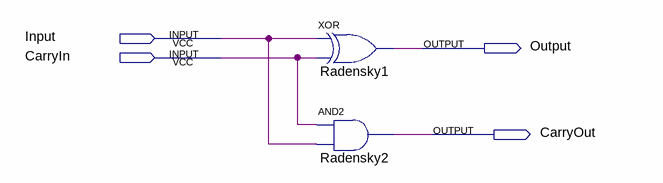
[diagram p0: schematic sheet]
// Quartus schematic RADENSKY_HALF_ADDER.bdf as structural Verilog: 2 symbols, 4 pins
module RADENSKY_HALF_ADDER (
  input  Input,
  input  CarryIn,
  output Output,
  output CarryOut
);

  xor Radensky1 (Output, Input, CarryIn);
  and Radensky2 (CarryOut, CarryIn, Input);
endmodule
